# EAGLE design controller (EAGLE 9.6.2)
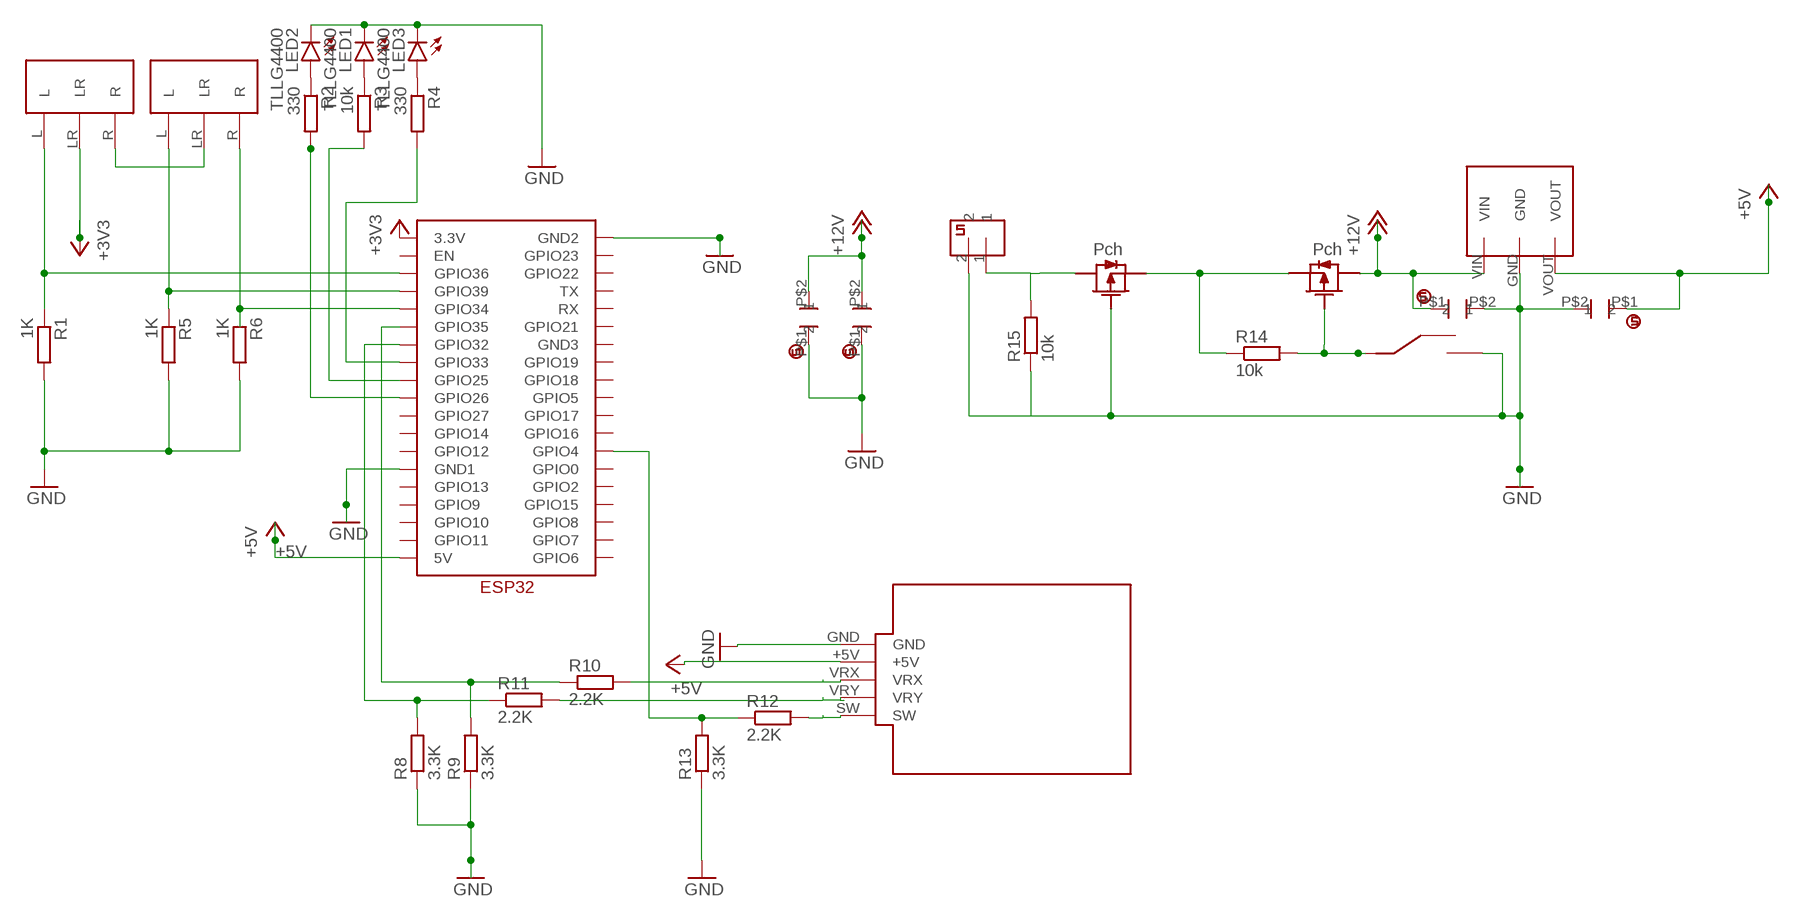
[diagram p0: schematic, sheet 1]

## Parts
CERAMIC_CAPACITOR1  CERAMIC_CAPACITOR  [CERAMIC_CAPACITOR]
CERAMIC_CAPACITOR2  CERAMIC_CAPACITOR  [CERAMIC_CAPACITOR]
CERAMIC_CAPACITOR3  CERAMIC_CAPACITOR  [CERAMIC_CAPACITOR]
CERAMIC_CAPACITOR4  CERAMIC_CAPACITOR  [CERAMIC_CAPACITOR]
CONNECTOR2  2PIN  [2PIN]
JOY1  JOYSTICK_WITH_PINSOCKET  [JOYSTICK]
LED1  TLLG4400  [LED3MM]
LED2  TLLG4400  [LED3MM]
LED3  TLLG4400  [LED3MM]
R1  1K  R-EU_0207/7  [0207/7]
R2  330  R-EU_0207/7  [0207/7]
R3  10k  R-EU_0207/7  [0207/7]
R4  330  R-EU_0207/7  [0207/7]
R5  1K  R-EU_0207/7  [0207/7]
R6  1K  R-EU_0207/7  [0207/7]
R8  3.3K  R-EU_0207/7  [0207/7]
R9  3.3K  R-EU_0207/7  [0207/7]
R10  2.2K  R-EU_0207/7  [0207/7]
R11  2.2K  R-EU_0207/7  [0207/7]
R12  2.2K  R-EU_0207/7  [0207/7]
R13  3.3K  R-EU_0207/7  [0207/7]
R14  10k  R-EU_0207/7  [0207/7]
R15  10k  R-EU_0207/7  [0207/7]
SRIDE_SWTCH1  SRIDE_SWITCH  [SRIDE_SWITCH]
SRIDE_SWTCH2  SRIDE_SWITCH  [SRIDE_SWITCH]
U$1  2SJ681-PCH  [2SJ681]
U$4  ESP32  [ESP32]
U$5  2SJ681-PCH  [2SJ681]
U$6  M78AR05-1  [M78AR05-1]
U$8  SLIDESWITCH  [SLIDESWITCH]

## Nets
+3V3: SRIDE_SWTCH1.LR U$4.3.3V
+5V: CERAMIC_CAPACITOR1.P$1 JOY1.+5V U$4.5V U$6.VOUT
+12V: CERAMIC_CAPACITOR2.P$1 CERAMIC_CAPACITOR3.P$2 CERAMIC_CAPACITOR4.P$2 U$5.DRAIN U$6.VIN
GND: CERAMIC_CAPACITOR1.P$2 CERAMIC_CAPACITOR2.P$2 CERAMIC_CAPACITOR3.P$1 CERAMIC_CAPACITOR4.P$1 CONNECTOR2.2 JOY1.GND LED1.K(C) LED2.K(C) LED3.K(C) R1.2 R5.2 R6.2 R8.1 R9.1 R13.1 R15.1 U$1.GATE U$4.GND1 U$6.GND U$8.C
N$1: U$4.GND2 ; supply symbol labelled GND
N$2: R14.1 U$1.SOURCE U$5.SOURCE
N$3: SRIDE_SWTCH1.R SRIDE_SWTCH2.LR
N$4: R14.2 U$5.GATE U$8.A
N$5: R1.1 SRIDE_SWTCH1.L U$4.GPIO36
N$6: CONNECTOR2.1 R15.2 U$1.DRAIN
N$7: R5.1 SRIDE_SWTCH2.L U$4.GPIO39
N$8: R6.1 SRIDE_SWTCH2.R U$4.GPIO34
N$9: JOY1.VRX R10.2
N$10: R9.2 R10.1 U$4.GPIO35
N$11: LED1.A R3.1
N$12: R12.1 R13.2 U$4.GPIO4
N$13: LED2.A R2.1
N$14: LED3.A R4.1
N$15: R4.2 U$4.GPIO33
N$16: R3.2 U$4.GPIO25
N$17: R2.2 U$4.GPIO26
N$18: JOY1.VRY R11.2
N$19: JOY1.SW R12.2
SCL: R8.2 R11.1 U$4.GPIO32
Unconnected: U$4.EN U$4.GND3 U$4.GPIO0 U$4.GPIO2 U$4.GPIO5 U$4.GPIO6 U$4.GPIO7 U$4.GPIO8 U$4.GPIO9 U$4.GPIO10 U$4.GPIO11 U$4.GPIO12 U$4.GPIO13 U$4.GPIO14 U$4.GPIO15 U$4.GPIO16 U$4.GPIO17 U$4.GPIO18 U$4.GPIO19 U$4.GPIO21 U$4.GPIO22 U$4.GPIO23 U$4.GPIO27 U$4.RX U$4.TX U$8.B

## Library data of the parts
CERAMIC_CAPACITOR1-CERAMIC_CAPACITOR4 = capacitor:CERAMIC_CAPACITOR: ceramic_capacitor
CONNECTOR2 = 2pin_small:2PIN: 2pin
JOY1 = Joycon_for_socialevent:JOYSTICK_WITH_PINSOCKET
LED1-LED3 = led:TLLG4400: Low Current (2mA) LED 3 mm Tinted Diffused Package color GREEN Source: Data sheet <http://www.farnell.com/datasheets/391098.pdf>; MF: VISHAY SEMICONDUCTOR; OC_FARNELL: 1612435
R1-R6 R8-R15 = rcl:R-EU_: RESISTOR, European symbol; SPICEPREFIX: R
SRIDE_SWTCH1 SRIDE_SWTCH2 = Sride Switch:SRIDE_SWITCH
U$1 U$5 = MOSFET:2SJ681-PCH
U$4 = ESP32:ESP32
U$6 = M78AR05-1:M78AR05-1
U$8 = SLIDESWITCH:SLIDESWITCH

## Net classes
0 default: width 0.381 mm, clearance 0.381 mm

## Board
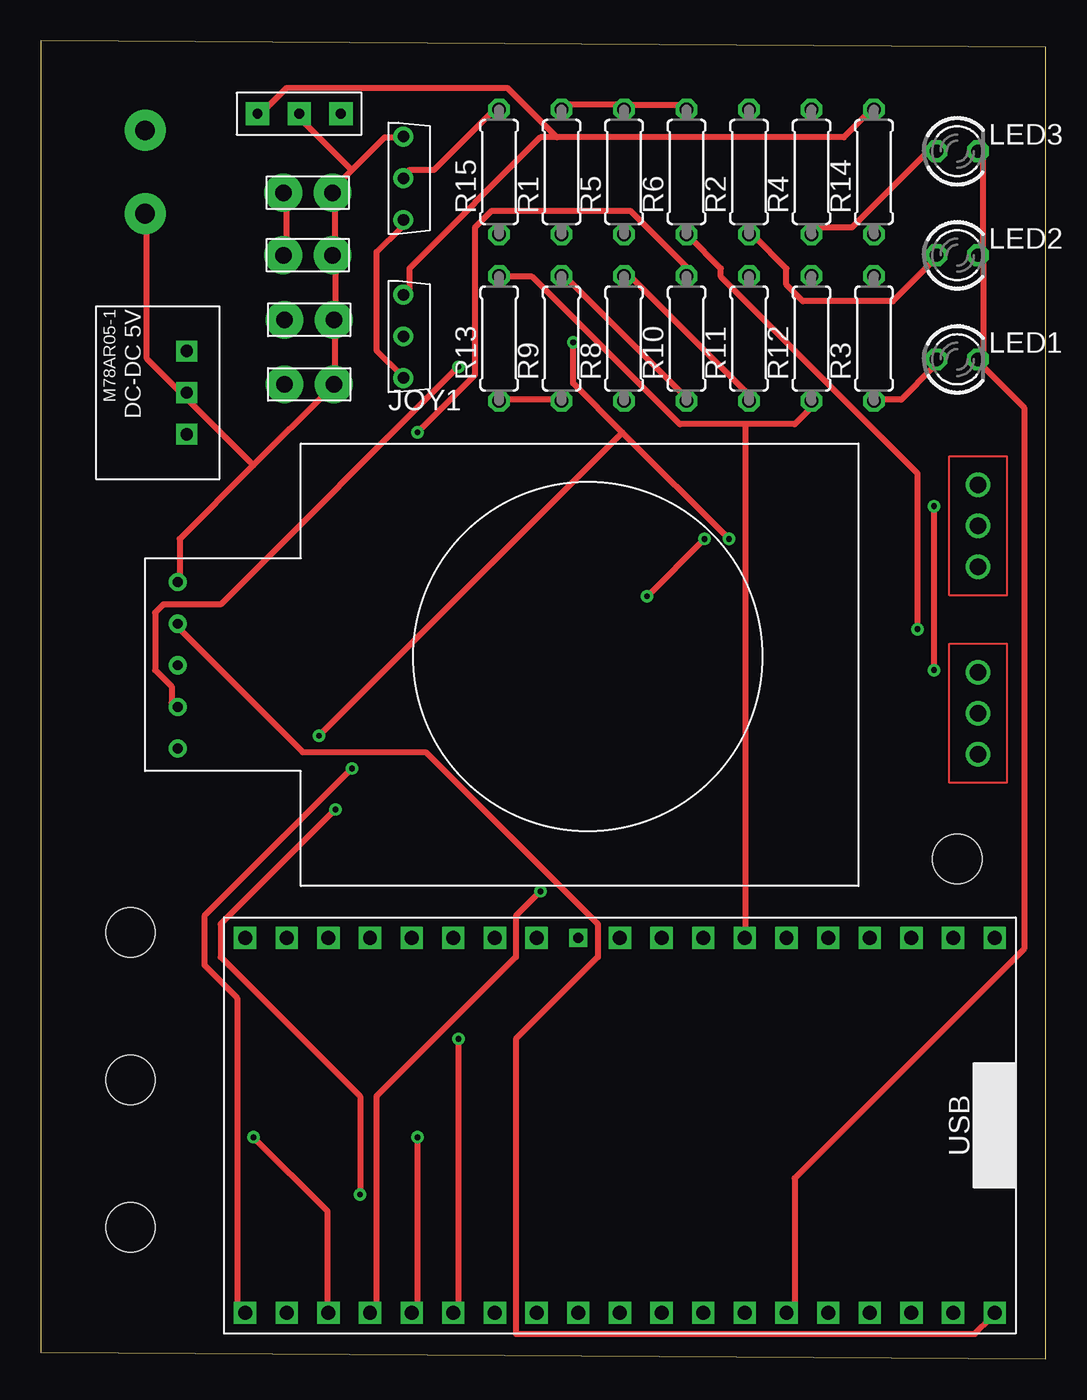
[diagram p1: board, top side]
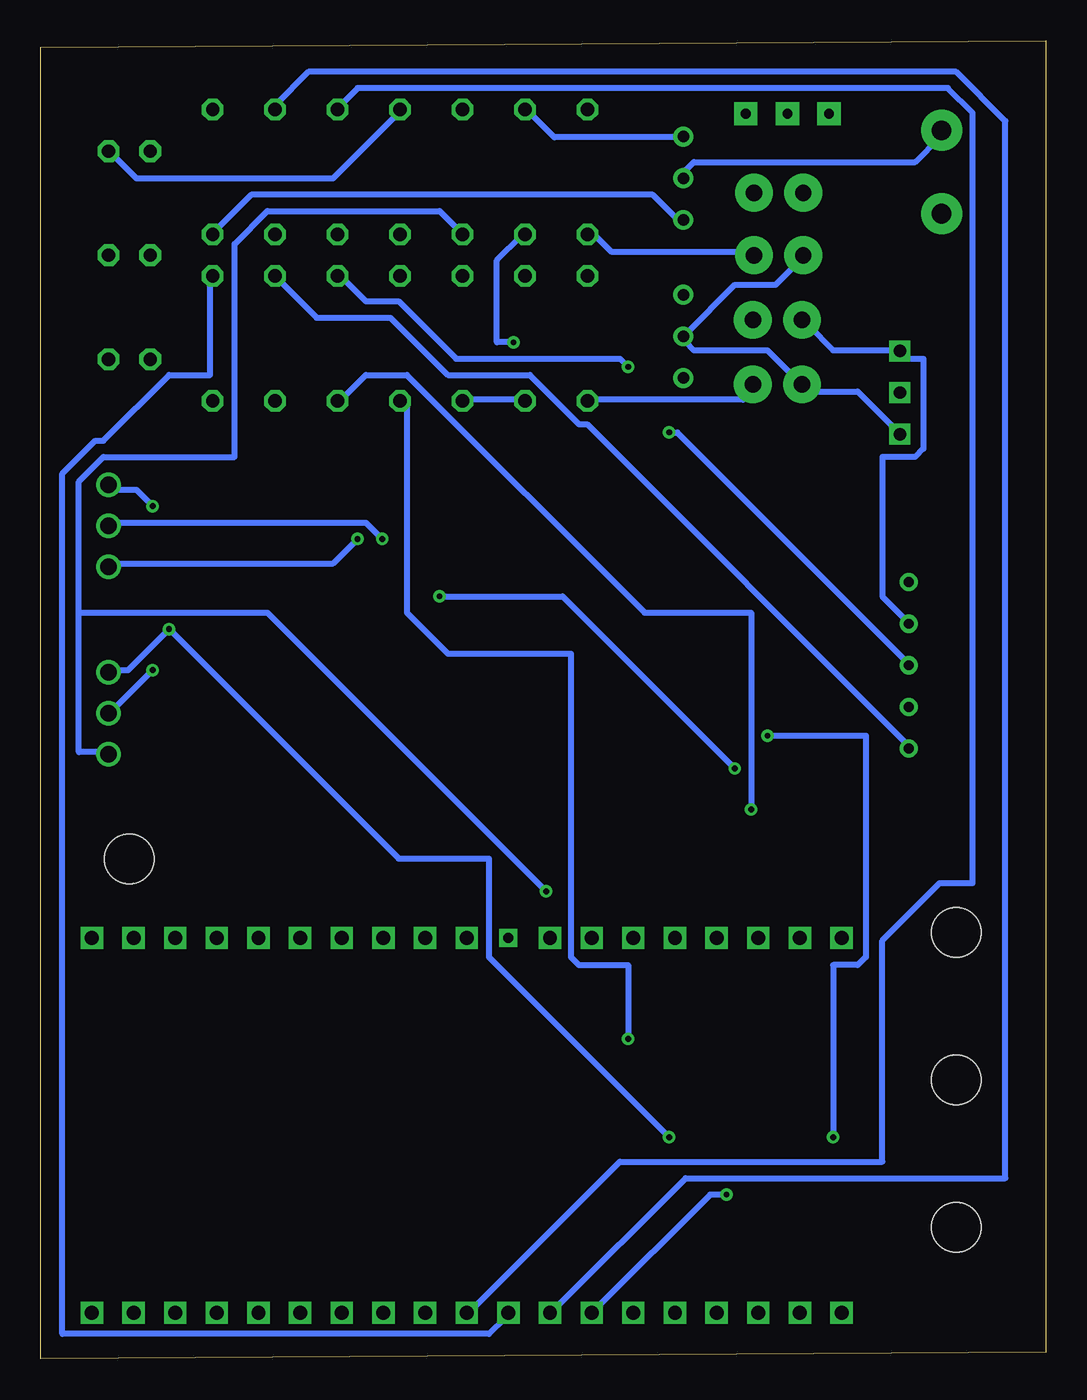
[diagram p2: board, bottom side, seen from below]

Size 61.27 x 80.38 mm. Coordinates in mm from the lower left corner, seen from the top.
Outline: 0,0.38 61.27,0 61.27,80 0,80.38 0,0.38
Copper layers (1*16): Top 0.035mm / dielectric 1.5mm / Bottom 0.035mm
Design rules "default": minimum track width 6mil, minimum drill 0.35mm, track to track 6mil, track to pad 6mil, pad to pad 6mil, via to via 6mil, smd to smd 6mil, copper to edge 40mil, drill to drill 6mil, minimum pad ring 10mil, minimum via ring 8mil, stop-mask expansion 4mil, vias tented up to drill 0mil, thermal gap 10mil
Holes 3 mm at 5.46,26 5.46,17 5.46,8 55.88,30.48

### Footprints (pad centres in the part's own frame; a part is rotated, then mirrored left to right if it is on the bottom)
CERAMIC_CAPACITOR = drill 1 pad 2.3: P$1 0,0; P$2 0,3
2PIN = drill 1.2 pad 2.5: 1 0,0; 2 5.08,0
JOYSTICK = drill 0.6: +5V 2,8; GND 2,10.54; SW 2,0.38; VRX 2,5.46; VRY 2,2.92
LED3MM = drill 0.813 octagon: A -1.27,0; K 1.27,0
0207/7 = drill 0.813 octagon: 1 -3.81,0; 2 3.81,0
SRIDE_SWITCH = drill 1: L -2.5,0; LR 0,0; R 2.5,0
2SJ681 = drill 0.7: DRAIN 0,0; GATE 2.54,0; SOURCE -2.54,0
ESP32 = drill 0.85 square: 3.3V 1.27,46.99; 5V 1.27,1.27; EN 1.27,44.45; GND1 1.27,13.97; GND2 24.13,46.99; GND3 24.13,31.75; GPIO0 24.13,13.97; GPIO2 24.13,11.43; GPIO4 24.13,16.51; GPIO5 24.13,24.13; GPIO6 24.13,1.27; GPIO7 24.13,3.81; GPIO8 24.13,6.35; GPIO9 1.27,8.89; GPIO10 1.27,6.35; GPIO11 1.27,3.81; GPIO12 1.27,16.51; GPIO13 1.27,11.43; GPIO14 1.27,19.05; GPIO15 24.13,8.89; GPIO16 24.13,19.05; GPIO17 24.13,21.59; GPIO19 24.13,29.21; GPIO21 24.13,34.29; GPIO22 24.13,41.91; GPIO23 24.13,44.45; GPIO25 1.27,26.67; GPIO26 1.27,24.13; GPIO27 1.27,21.59; GPIO32 1.27,31.75; GPIO33 1.27,29.21; GPIO34 1.27,36.83; GPIO35 1.27,34.29; GPIO36 1.27,41.91; GPIO39 1.27,39.37; RX 24.13,36.83; TX 24.13,39.37 | drill 0.6 square: GPIO18 24.13,26.67
M78AR05-1 = drill 0.75 pad 1.27 square: GND 0,0; VIN 2.54,0; VOUT -2.54,0
SLIDESWITCH = drill 0.6 pad 1.422 square: A 0,0; B 5.08,0; C 2.54,0

### Placement (x,y rotation side)
CERAMIC_CAPACITOR1  14.86,63.37 270 top
CERAMIC_CAPACITOR2  14.86,59.44 270 top
CERAMIC_CAPACITOR3  17.78,71.12 90 top
CERAMIC_CAPACITOR4  17.78,67.31 90 top
CONNECTOR2  6.35,74.93 270 top
JOY1  6.35,36.83 0 top
LED1  55.88,60.96 0 top
LED2  55.88,67.31 0 top
LED3  55.88,73.66 0 top
R1  31.75,72.39 90 top
R2  43.18,72.39 90 top
R3  50.8,62.23 90 top
R4  46.99,72.39 90 top
R5  35.56,72.39 90 top
R6  39.37,72.39 90 top
R8  35.56,62.23 90 top
R9  31.75,62.23 90 top
R10  39.37,62.23 90 top
R11  43.18,62.23 90 top
R12  46.99,62.23 90 top
R13  27.94,62.23 90 top
R14  50.8,72.39 90 top
R15  27.94,72.39 90 top
SRIDE_SWTCH1  57.15,50.8 90 top
SRIDE_SWTCH2  57.15,39.37 90 top
U$1  22.1,72.01 90 top
U$4  59.44,1.52 90 top
U$5  22.1,62.36 90 top
U$6  8.89,58.93 270 top
U$8  13.21,75.95 0 top

### Tracks (layer width: path | path; a pad name or v marks a point on that pad's centre or on a via)
+3V3  (via drill 0.35)
  Top 0.381: v18.96,36 9.96,27 9.96,24 11.96,22 11.96,3 U$4.3.3V | v40.46,50 v36.96,46.5
  Bottom 0.381: v18.96,36 29.46,46.5 v36.96,46.5 | v40.46,50 41.46,51 56.96,51 SRIDE_SWTCH1.LR
+5V
  Top 0.381: U$4.5V 57.96,2.5 56.96,1.5 28.96,1.5 28.96,19.5 33.96,24.5 33.96,26.5 23.46,37 15.96,37 8.46,44.5 JOY1.+5V
  Bottom 0.381: JOY1.+5V 8.46,45 9.96,46.5 9.96,55 7.96,55 7.46,55.5 7.46,61 8.46,61 U$6.VOUT 8.96,61.5 12.96,61.5 14.46,63 CERAMIC_CAPACITOR1.P$1
+12V
  Top 0.381: CERAMIC_CAPACITOR4.P$2 14.96,67.5 14.96,71 CERAMIC_CAPACITOR3.P$2
  Bottom 0.381: U$6.VIN 8.96,56.5 11.46,59 14.46,59 CERAMIC_CAPACITOR2.P$1 14.96,59.5 16.96,61.5 21.46,61.5 21.96,62 U$5.DRAIN 21.96,62.5 18.96,65.5 16.46,65.5 14.96,67 CERAMIC_CAPACITOR4.P$2
GND
  Top 0.381: R1.2 31.96,76.5 35.46,76.5 R5.2 35.96,76.5 38.96,76.5 R6.2 | 18.96,72.5 17.96,71.5 CERAMIC_CAPACITOR3.P$1 17.96,71 17.96,67.5 CERAMIC_CAPACITOR4.P$1 17.96,67 17.96,63.5 CERAMIC_CAPACITOR1.P$2 17.96,63 17.96,59.5 CERAMIC_CAPACITOR2.P$2 17.46,59 12.96,54.5 | 18.96,72.5 20.96,74.5 21.96,74.5 U$1.GATE | 18.96,72.5 15.96,75.5 U$8.C | R13.1 27.96,58.5 31.46,58.5 R9.1 | 12.96,54.5 8.46,50 8.46,47.5 JOY1.GND | 12.96,54.5 8.96,58.5 U$6.GND 8.46,59 6.46,61 6.46,69.5 CONNECTOR2.2 | LED3.K 57.46,73.5 57.46,67.5 LED2.K 57.46,67 57.46,61 LED1.K 57.46,60.5 59.96,58 59.96,25 45.96,11 45.96,3 U$4.GND1
  Bottom 0.381: R1.2 31.46,76 29.96,74.5 22.46,74.5 U$1.GATE | R15.1 27.46,68.5 26.46,67.5 17.96,67.5 CERAMIC_CAPACITOR4.P$1 | R8.1 35.46,58.5 31.96,58.5 R9.1 | R13.1 27.46,58.5 18.46,58.5 17.96,59 CERAMIC_CAPACITOR2.P$2 | R6.2 39.46,76 43.46,72 55.46,72 56.96,73.5 LED3.K
N$2
  Top 0.381: U$5.SOURCE 21.96,60 20.46,61.5 20.46,67.5 21.96,69 U$1.SOURCE
  Bottom 0.381: R14.1 50.46,69 48.46,71 23.96,71 22.46,69.5 U$1.SOURCE
N$3  (via drill 0.35)
  Top 0.381: v54.46,52 v54.46,42
  Bottom 0.381: v54.46,42 56.96,39.5 SRIDE_SWTCH2.LR | v54.46,52 55.46,53 56.96,53 SRIDE_SWTCH1.R
N$4
  Top 0.381: 31.46,74.5 48.96,74.5 50.46,76 R14.2 | 31.46,74.5 30.46,74.5 22.46,66.5 22.46,65 U$5.GATE | 31.46,74.5 28.46,77.5 14.96,77.5 13.46,76 U$8.A
N$5  (via drill 0.35)
  Top 0.381: v32.46,62 32.46,59.5 35.46,56.5 | v41.96,50 35.46,56.5 | v12.96,13.5 17.46,9 17.46,3 U$4.GPIO36 | 35.46,56.5 v16.96,38
  Bottom 0.381: v32.46,62 33.46,62 33.46,67 31.96,68.5 R1.1 | v41.96,50 43.46,48.5 56.96,48.5 SRIDE_SWTCH1.L | v12.96,13.5 12.96,24 11.46,24 10.96,24.5 10.96,38 v16.96,38
N$6
  Top 0.381: U$1.DRAIN 22.46,72.5 23.96,72.5 27.46,76 R15.2
  Bottom 0.381: CONNECTOR2.1 6.46,74.5 7.96,73 21.46,73 21.96,72.5 U$1.DRAIN
N$7  (via drill 0.35)
  Top 0.381: v30.46,28.5 28.96,27 28.96,24.5 20.46,16 20.46,3 U$4.GPIO39
  Bottom 0.381: 58.96,45.5 58.96,37 57.46,37 SRIDE_SWTCH2.L | 58.96,45.5 58.96,53.5 57.46,55 49.46,55 49.46,68 47.46,70 36.96,70 35.96,69 R5.1 | v30.46,28.5 47.46,45.5 58.96,45.5
N$8  (via drill 0.35)
  Top 0.381: v53.46,44.5 53.46,54 41.46,66 41.46,66.5 39.46,68.5 R6.1 | v22.96,13.5 22.96,3 U$4.GPIO34
  Bottom 0.381: SRIDE_SWTCH2.R 56.96,42 55.96,42 v53.46,44.5 39.46,30.5 33.96,30.5 33.96,24.5 v22.96,13.5
N$9  (via drill 0.35)
  Top 0.381: v22.96,56.5 26.46,60 26.46,69 27.46,70 35.96,70 39.46,66.5 R10.2
  Bottom 0.381: v22.96,56.5 22.46,56.5 8.46,42.5 JOY1.VRX
N$10  (via drill 0.35)
  Top 0.381: R9.2 31.96,66 39.46,58.5 R10.1 | v25.46,19.5 25.46,3 U$4.GPIO35
  Bottom 0.381: v25.46,19.5 25.46,24 28.46,24 28.96,24.5 28.96,43 36.46,43 38.96,45.5 38.96,58 R10.1
N$11
  Top 0.381: R3.1 50.96,58.5 52.46,58.5 54.46,60.5 LED1.A
N$12
  Top 0.381: 42.96,57 45.96,57 46.96,58 R12.1 | 42.96,57 38.96,57 29.96,66 27.96,66 R13.2 | 42.96,57 42.96,26 U$4.GPIO4
N$13
  Top 0.381: R2.1 43.46,68.5 45.46,66.5 45.46,65.5 46.46,64.5 51.96,64.5 54.46,67 LED2.A
N$14
  Top 0.381: R4.1 47.46,69 49.46,69 54.46,74 LED3.A
N$15
  Bottom 0.381: R4.2 46.96,76.5 44.96,78.5 5.46,78.5 2.46,75.5 2.46,11 21.96,11 29.96,3 U$4.GPIO33
N$16
  Bottom 0.381: R3.2 50.96,66 50.96,60 53.46,60 57.46,56 57.96,56 59.96,54 59.96,1.5 33.96,1.5 32.96,2.5 U$4.GPIO25
N$17
  Bottom 0.381: R2.2 42.96,76.5 41.96,77.5 5.96,77.5 4.46,76 4.46,29 6.46,29 9.96,25.5 9.96,12 25.96,12 34.96,3 U$4.GPIO26
N$18  (via drill 0.35)
  Top 0.381: v25.46,60.5 10.96,46 7.46,46 6.96,45.5 6.96,42 7.96,41 7.96,40 JOY1.VRY
  Bottom 0.381: v25.46,60.5 25.96,61 35.96,61 39.46,64.5 41.46,64.5 42.96,66 R11.2
N$19
  Bottom 0.381: JOY1.SW 8.46,37.5 27.96,57 28.46,57 31.46,60 36.46,60 39.96,63.5 44.46,63.5 46.96,66 R12.2
SCL  (via drill 0.35)
  Top 0.381: R8.2 35.96,66 43.46,58.5 R11.1 | v19.46,10 19.46,16 10.96,24.5 10.96,26.5 v17.96,33.5
  Bottom 0.381: v19.46,10 20.46,10 27.46,3 U$4.GPIO32 | v17.96,33.5 17.96,45.5 24.46,45.5 38.96,60 41.46,60 42.96,58.5 R11.1